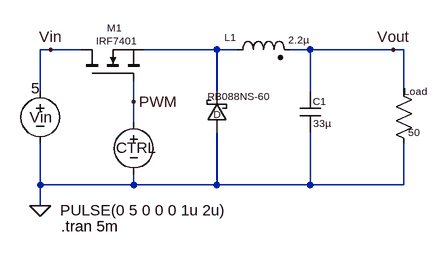
[diagram p0: schematic Buck Converter 5to3V3.asc]
Buck Converter 5to3V3.asc, the LTspice schematic file:
Version 4
SHEET 1 1852 680
WIRE 1264 -224 1248 -224
WIRE 1312 -224 1264 -224
WIRE 1520 -224 1408 -224
WIRE 1552 -224 1520 -224
WIRE 1664 -224 1632 -224
WIRE 1792 -224 1664 -224
WIRE 1808 -224 1792 -224
WIRE 1248 -160 1248 -224
WIRE 1520 -160 1520 -224
WIRE 1664 -160 1664 -224
WIRE 1808 -160 1808 -224
WIRE 1392 -144 1392 -176
WIRE 1392 -112 1392 -144
WIRE 1248 -16 1248 -80
WIRE 1392 -16 1392 -32
WIRE 1392 -16 1248 -16
WIRE 1520 -16 1520 -96
WIRE 1520 -16 1392 -16
WIRE 1664 -16 1664 -96
WIRE 1664 -16 1520 -16
WIRE 1808 -16 1808 -80
WIRE 1808 -16 1664 -16
WIRE 1248 16 1248 -16
FLAG 1792 -224 Vout
FLAG 1248 16 0
FLAG 1264 -224 Vin
FLAG 1392 -144 PWM
SYMBOL voltage 1248 -176 R0
WINDOW 0 -16 56 Left 2
WINDOW 123 0 0 Left 0
WINDOW 39 0 0 Left 0
WINDOW 3 -14 11 Left 2
SYMATTR InstName Vin
SYMATTR Value 5
SYMBOL schottky 1536 -96 R180
WINDOW 0 10 29 Left 1
WINDOW 3 -64 56 Left 1
SYMATTR InstName D
SYMATTR Value RB088NS-60
SYMATTR Description Diode
SYMATTR Type diode
SYMBOL res 1824 -64 R180
WINDOW 0 -20 96 Left 1
WINDOW 3 -9 33 Left 1
SYMATTR InstName Load
SYMATTR Value 50
SYMBOL cap 1648 -160 R0
WINDOW 0 20 15 Left 1
WINDOW 3 21 49 Left 1
SYMATTR InstName C1
SYMATTR Value 33µ
SYMBOL ind2 1536 -208 R270
WINDOW 0 25 5 VTop 1
WINDOW 3 42 110 VBottom 1
SYMATTR InstName L1
SYMATTR Value 2.2µ
SYMATTR SpiceLine Ipk=17 Rser=0.0052 Rpar=2269 Cpar=4.744p
SYMATTR Type ind
SYMBOL nmos 1312 -176 R270
WINDOW 0 82 39 VRight 1
WINDOW 3 62 22 VRight 1
SYMATTR InstName M1
SYMATTR Value IRF7401
SYMBOL voltage 1392 -128 R0
WINDOW 0 -27 55 Left 2
WINDOW 123 0 0 Left 0
WINDOW 39 0 0 Left 0
WINDOW 3 -113 151 Left 2
SYMATTR InstName CTRL
SYMATTR Value PULSE(0 5 0 0 0 1u 2u)
TEXT 1280 48 Left 2 !.tran 5m

The netlist it stands for:
* Buck Converter 5to3V3.asc
Vin Vin 0 5
D 0 N001 RB088NS-60
R§Load 0 Vout 50
C1 Vout 0 33µ
L1 N001 Vout 2.2µ Ipk=17 Rser=0.0052 Rpar=2269 Cpar=4.744p
M1 Vin PWM N001 N001 IRF7401
V§CTRL PWM 0 PULSE(0 5 0 0 0 1u 2u)
.model D D
.lib standard.dio
.model NMOS NMOS
.model PMOS PMOS
.lib standard.mos
.tran 5m
.backanno
.end